# Altium schematic sheet Battery In.SchDoc: Battery Input Circuitry
size B; DrawnBy: Adam Vadala-Roth; Revision: 1.1b; SheetNumber: 1; SheetTotal: 1
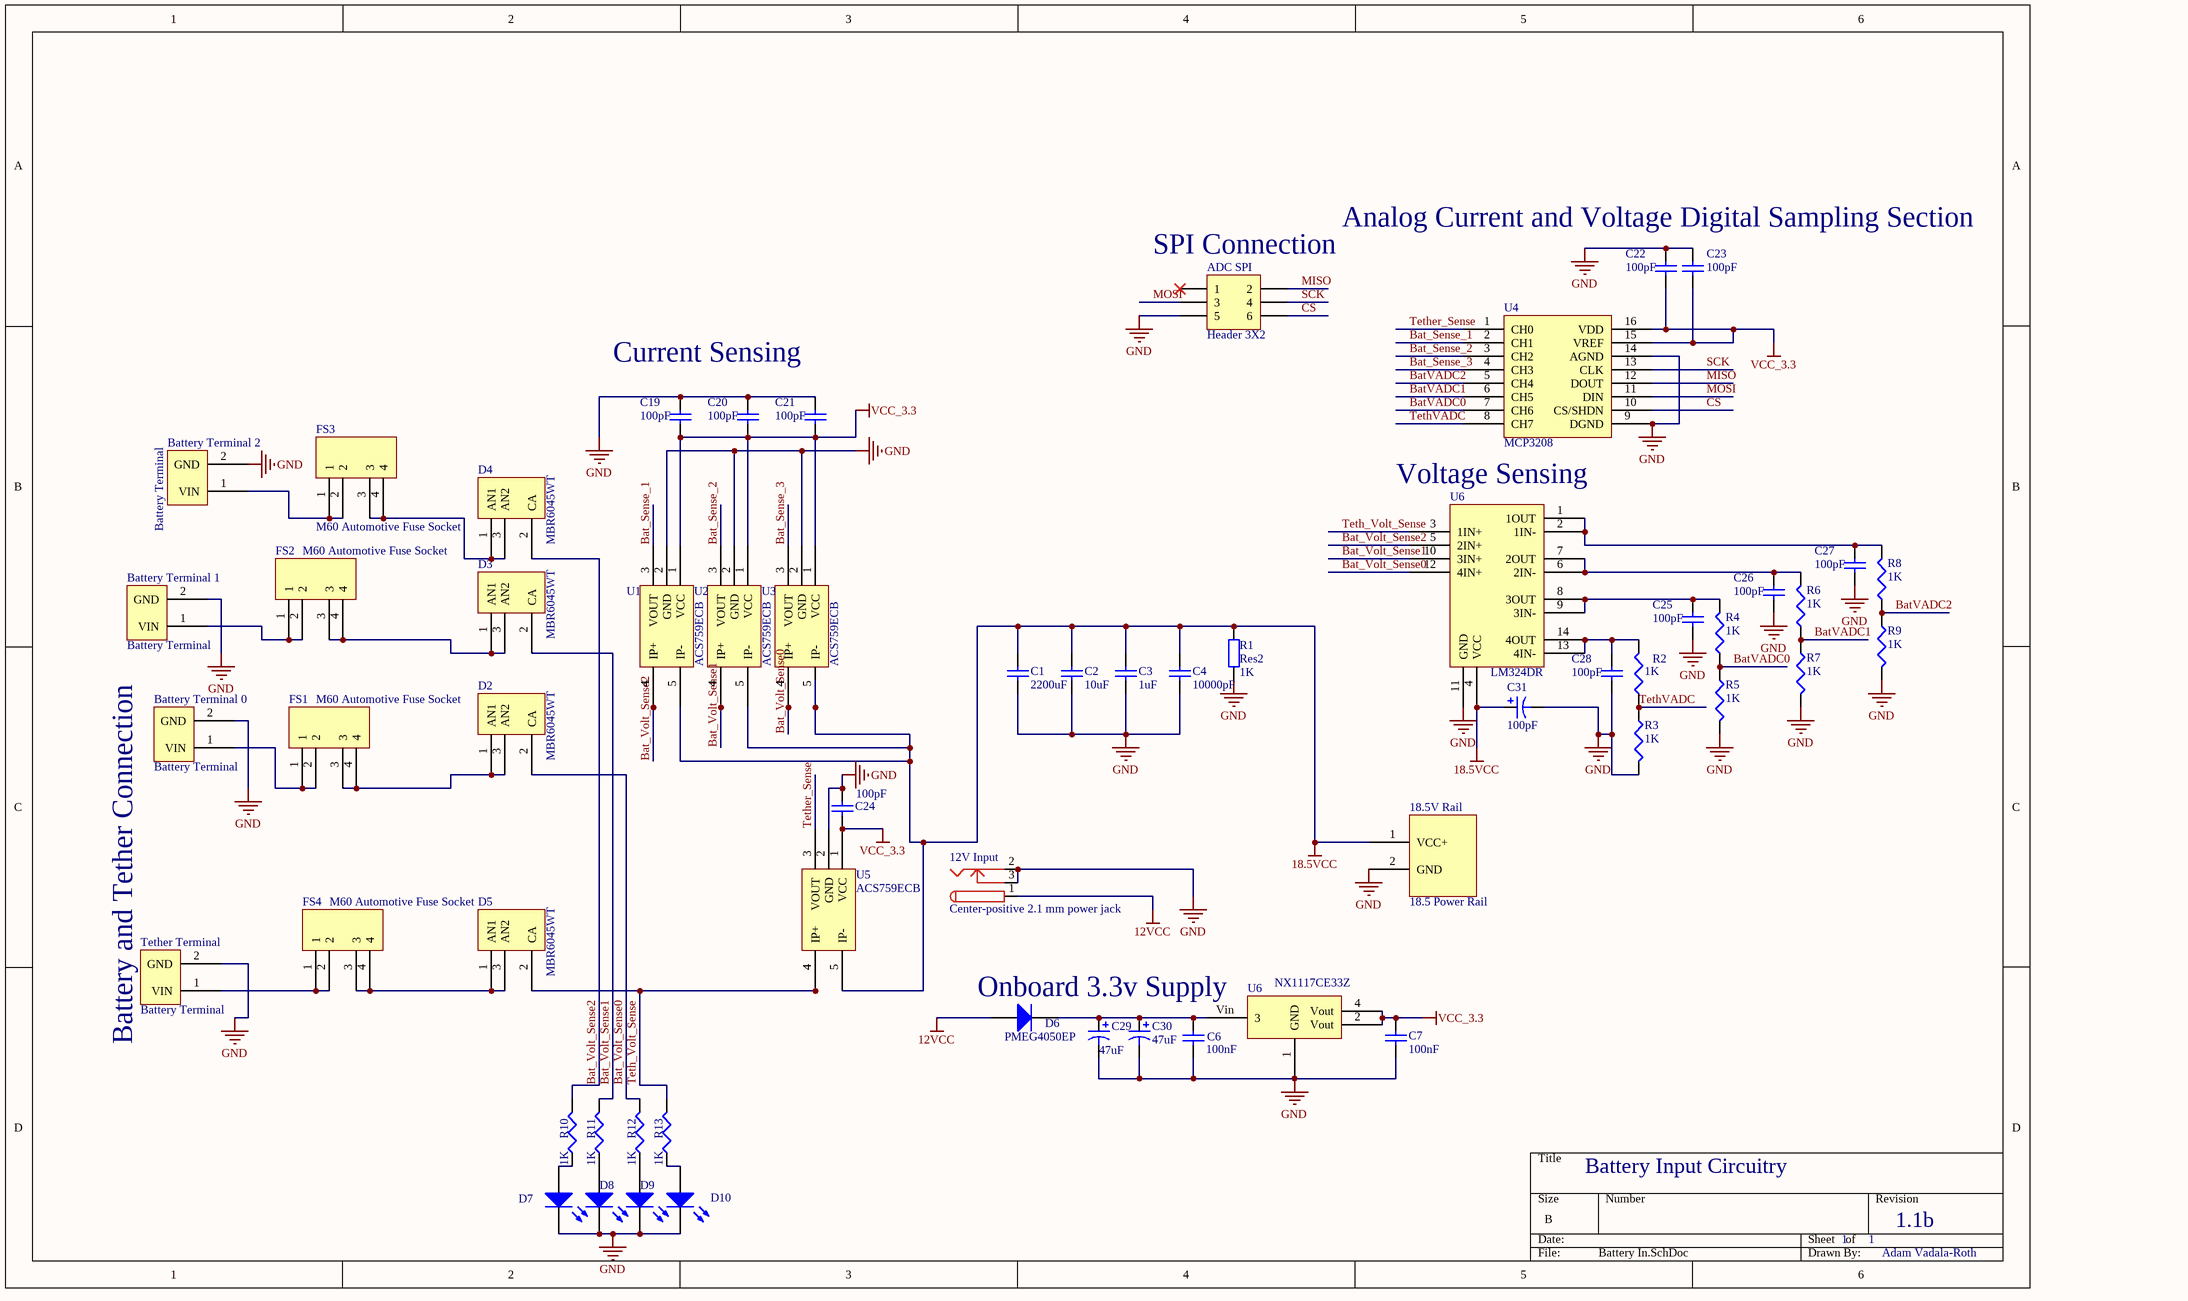
[diagram p0: Battery In.SchDoc]

## Parts
(Parts that share a designator on the sheet are numbered #1, #2 ... from top to bottom, then left to right.)
12V_Input  Center-positive 2.1 mm power jack  [PJ-102AH]
18.5V_Rail  18.5 Power Rail  [Power Rail Pad]
ADC_SPI  Header 3X2  [HDR2X3]
Battery_Terminal_0  Battery Terminal  [Battery Terminal]
Battery_Terminal_1  Battery Terminal  [Battery Terminal]
Battery_Terminal_2  Battery Terminal  [Battery Terminal]
C1  value 2200uF  [CAPPR5-12.5x40]
C2  value 10uF  [CAPPR2-5x11]
C3  value 1uF  [CAPPR2-5x11]
C4  value 10000pF  [CAPRD5-6.5x4.5]
C6  value 100nF  [C1206]  (hidden comment: Cap Semi)
C7  value 100nF  [C1206]  (hidden comment: Cap Semi)
C19  value 100pF  [C1206]  (hidden comment: Cap Semi)
C20  value 100pF  [C1206]  (hidden comment: Cap Semi)
C21  value 100pF  [C1206]  (hidden comment: Cap Semi)
C22  value 100pF  [C1206]  (hidden comment: Cap Semi)
C23  value 100pF  [C1206]  (hidden comment: Cap Semi)
C24  value 100pF  [C1206]  (hidden comment: Cap Semi)
C25  value 100pF  [C1206]  (hidden comment: Cap Semi)
C26  value 100pF  [C1206]  (hidden comment: Cap Semi)
C27  value 100pF  [C1206]  (hidden comment: Cap Semi)
C28  value 100pF  [C1206]  (hidden comment: Cap Semi)
C29  value 47uF  [CAPPR2.5-6.3x5]  (hidden comment: Cap Pol1)
C30  value 47uF  [CAPPR2.5-6.3x5]  (hidden comment: Cap Pol1)
C31  value 100pF  [CAPPR2.5-6.3x5]  (hidden comment: Cap Pol1)
D2  MBR6045WT  [MBR6045WT]
D3  MBR6045WT  [MBR6045WT]
D4  MBR6045WT  [MBR6045WT]
D5  MBR6045WT  [MBR6045WT]
D6  PMEG4050EP  [NXP Schottkey reverse]
D7  LED2  [3.2X1.6X1.1]  (value not drawn)
D8  LED2  [3.2X1.6X1.1]  (value not drawn)
D9  LED2  [3.2X1.6X1.1]  (value not drawn)
D10  LED2  [3.2X1.6X1.1]  (value not drawn)
FS1  M60 Automotive Fuse Socket  [M60]
FS2  M60 Automotive Fuse Socket  [M60]
FS3  M60 Automotive Fuse Socket  [M60]
FS4  M60 Automotive Fuse Socket  [M60]
R1  Res2  value 1K  [AXIAL-0.4]
R2  value 1K  [RESC3216L]  (hidden comment: Res3)
R3  value 1K  [RESC3216L]  (hidden comment: Res3)
R4  value 1K  [RESC3216L]  (hidden comment: Res3)
R5  value 1K  [RESC3216L]  (hidden comment: Res3)
R6  value 1K  [RESC3216L]  (hidden comment: Res3)
R7  value 1K  [RESC3216L]  (hidden comment: Res3)
R8  value 1K  [RESC3216L]  (hidden comment: Res3)
R9  value 1K  [RESC3216L]  (hidden comment: Res3)
R10  value 1K  [14-1210]  (hidden comment: Res3)
R11  value 1K  [14-1210]  (hidden comment: Res3)
R12  value 1K  [14-1210]  (hidden comment: Res3)
R13  value 1K  [14-1210]  (hidden comment: Res3)
Tether_Terminal  Battery Terminal  [Battery Terminal]
U1  ACS759ECB  [ACS759ECB Round Holes]
U2  ACS759ECB  [ACS759ECB Round Holes]
U3  ACS759ECB  [ACS759ECB Round Holes]
U4  MCP3208  [MCP3208 - duplicate]
U5  ACS759ECB  [ACS759ECB Round Holes]
U6#1  LM324DR  [LM324DR - duplicate]
U6#2  NX1117CE33Z  [NX1117CE33Z]

## Nets
12VCC: 12V_Input.1 D6.1(A)
18.5VCC: 18.5V_Rail.1(VCC+) C1.1 C2.1 C3.1 C4.1 C31.1 R1.2 U1.5(IP-) U2.5(IP-) U3.5(IP-) U5.5(IP-) U6#1.4(VCC)
GND: 12V_Input.2 12V_Input.3 18.5V_Rail.2(GND) ADC_SPI.5 Battery_Terminal_0.2(GND) Battery_Terminal_1.2(GND) Battery_Terminal_2.2(GND) C1.2 C2.2 C3.2 C4.2 C6.1 C7.1 C19.2 C20.2 C21.2 C22.2 C23.2 C24.2 C25.1 C26.1 C27.1 C28.1 C29.2 C30.2 C31.2 D7.2(K) D8.2(K) D9.2(K) D10.2(K) R1.1 R3.2 R5.2 R7.2 R9.2 Tether_Terminal.2(GND) U1.2(GND) U2.2(GND) U3.2(GND) U4.9(DGND) U4.14(AGND) U5.2(GND) U6#1.11(GND) U6#2.1(GND)
VCC_3.3: C7.2 C19.1 C20.1 C21.1 C22.1 C23.1 C24.1 U1.1(VCC) U2.1(VCC) U3.1(VCC) U4.15(VREF) U4.16(VDD) U5.1(VCC) U6#2.2(Vout) U6#2.4(Vout)
Bat_Sense_1: U1.3(VOUT) U4.2(CH1)
Bat_Sense_2: U2.3(VOUT) U4.3(CH2)
Bat_Sense_3: U3.3(VOUT) U4.4(CH3)
Bat_Volt_Sense0: D2.2(CA) R12.2 U3.4(IP+) U6#1.12(4IN+)
Bat_Volt_Sense1: D3.2(CA) R11.2 U2.4(IP+) U6#1.10(3IN+)
Bat_Volt_Sense2: D4.2(CA) R10.2 U1.4(IP+) U6#1.5(2IN+)
BatVADC0: R4.1 R5.1 U4.7(CH6)
BatVADC1: R6.1 R7.1 U4.6(CH5)
BatVADC2: R8.1 R9.1 U4.5(CH4)
CS: ADC_SPI.6 U4.10(CS/SHDN)
MISO: ADC_SPI.2 U4.12(DOUT)
MOSI: ADC_SPI.3 U4.11(DIN)
SCK: ADC_SPI.4 U4.13(CLK)
Teth_Volt_Sense: D5.2(CA) R13.2 U5.4(IP+) U6#1.3(1IN+)
Tether_Sense: U4.1(CH0) U5.3(VOUT)
TethVADC: R2.1 R3.1 U4.8(CH7)
NetBattery_Terminal_0_1: Battery_Terminal_0.1(VIN) FS1.1 FS1.2
NetBattery_Terminal_1_1: Battery_Terminal_1.1(VIN) FS2.1 FS2.2
NetBattery_Terminal_2_1: Battery_Terminal_2.1(VIN) FS3.1 FS3.2
NetC6_2: C6.2 C29.1 C30.1 D6.2(K) U6#2.Vin(3)
NetC25_2: C25.2 R4.2 U6#1.8(3OUT) U6#1.9(3IN-)
NetC26_2: C26.2 R6.2 U6#1.6(2IN-) U6#1.7(2OUT)
NetC27_2: C27.2 R8.2 U6#1.1(1OUT) U6#1.2(1IN-)
NetC28_2: C28.2 R2.2 U6#1.13(4IN-) U6#1.14(4OUT)
NetD2_1: D2.1(AN1) D2.3(AN2) FS1.3 FS1.4
NetD3_1: D3.1(AN1) D3.3(AN2) FS2.3 FS2.4
NetD4_1: D4.1(AN1) D4.3(AN2) FS3.3 FS3.4
NetD5_1: D5.1(AN1) D5.3(AN2) FS4.3 FS4.4
NetD7_1: D7.1(A) R10.1
NetD8_1: D8.1(A) R11.1
NetD9_1: D9.1(A) R12.1
NetD10_1: D10.1(A) R13.1
NetFS4_1: FS4.1 FS4.2 Tether_Terminal.1(VIN)

Not connected (* = marked no-connect by the designer): ADC_SPI 1*

## Notes on the sheet
- Analog Current and Voltage Digital Sampling Section
- (near ADC_SPI) SPI Connection
- Current Sensing
- Voltage Sensing
- Battery and Tether Connection
- Onboard 3.3v Supply

## Library data of the parts
12V_Input = PWR2.5: Power jack; Published: 17-Dec-2003; DatasheetDocument: 09-May-2002; Publisher: Altium Limited; ComponentLink1Description: Manufacturer Link; ComponentLink1URL: http://domino.kycon.com/internet/Products.html
ADC_SPI = Header 3X2: Header, 3-Pin, Dual row; LatestRevisionDate: 17-Jul-2002; LatestRevisionNote: Re-released for DXP Platform.; Publisher: Altium Limited
C1-C4 = Cap: Capacitor; Published: 8-Jun-2000; LatestRevisionDate: 17-Jul-2002; LatestRevisionNote: Re-released for DXP Platform.; PackageReference: RAD-0.3; Publisher: Altium Limited; PackageDescription: Radial Cap, Thru-Hole; 2 Leads; 0.3 in Pin Spacing
C6 C7 C19-C28 = Cap Semi: Capacitor (Semiconductor SIM Model); Published: 8-Jun-2000; LatestRevisionDate: 29-May-2009; LatestRevisionNote: IPC-7351 Footprint Added.; PackageReference: C1206; Publisher: Altium Limited; PackageDescription: Chip Capacitor
C29-C31 = Cap Pol1: Polarized Capacitor (Radial); Published: 8-Jun-2000; LatestRevisionDate: 17-Jul-2002; LatestRevisionNote: Re-released for DXP Platform.; PackageReference: RB7.6-15; Publisher: Altium Limited; PackageDescription: Polarized Capacitor (Radial); 2 Leads
D6 = Diode: Default Diode; Published: 8-Jun-2000; LatestRevisionDate: 17-Jul-2002; LatestRevisionNote: Re-released for DXP Platform.; PackageVersion: Sep-1996; PackageReference: SMC; Publisher: Altium Limited; PackageDescription: DO-214-AB/SMC; 2 C-Bend Leads; Body 7.9 x 5.9 mm, inc. leads (LxW); Code_JEDEC: DO-214-AB
D7-D10 = LED2: Typical RED, GREEN, YELLOW, AMBER GaAs LED; Published: 8-Jun-2000; LatestRevisionDate: 17-Jul-2002; LatestRevisionNote: Re-released for DXP Platform.; PackageVersion: Feb-2002; PackageReference: 3.2X1.6X1.1; Publisher: Altium Limited; PackageDescription: SM LED; 2 Flat Leads
FS1-FS4 = M60 Automotive Fuse: Automotive Fuse Socket
R1 = Res2: Resistor; Published: 8-Jun-2000; LatestRevisionDate: 17-Jul-2002; LatestRevisionNote: Re-released for DXP Platform.; PackageReference: AXIAL-0.4; Publisher: Altium Limited; PackageDescription: Axial Device, Thru-Hole; 2 Leads; 0.4 in Pin Spacing
R2-R13 = Res3: Resistor; Published: 8-Jun-2000; LatestRevisionDate: 29-May-2009; LatestRevisionNote: IPC-7351 Footprint Added.; PackageReference: J1-0603; Publisher: Altium Limited; PackageDescription: Chip Resistor
U6#2 = NX1117CE33Z: 3.3v Linear Regulator